# Altium schematic sheet Main.SchDoc: GMU HY
size 353 x 250 mm; Date: 17.10.2024r.; Author: Bartłomiej Smoter; CompanyName: AGH Racing; Revision: v1; SheetNumber: 1; SheetTotal: 6
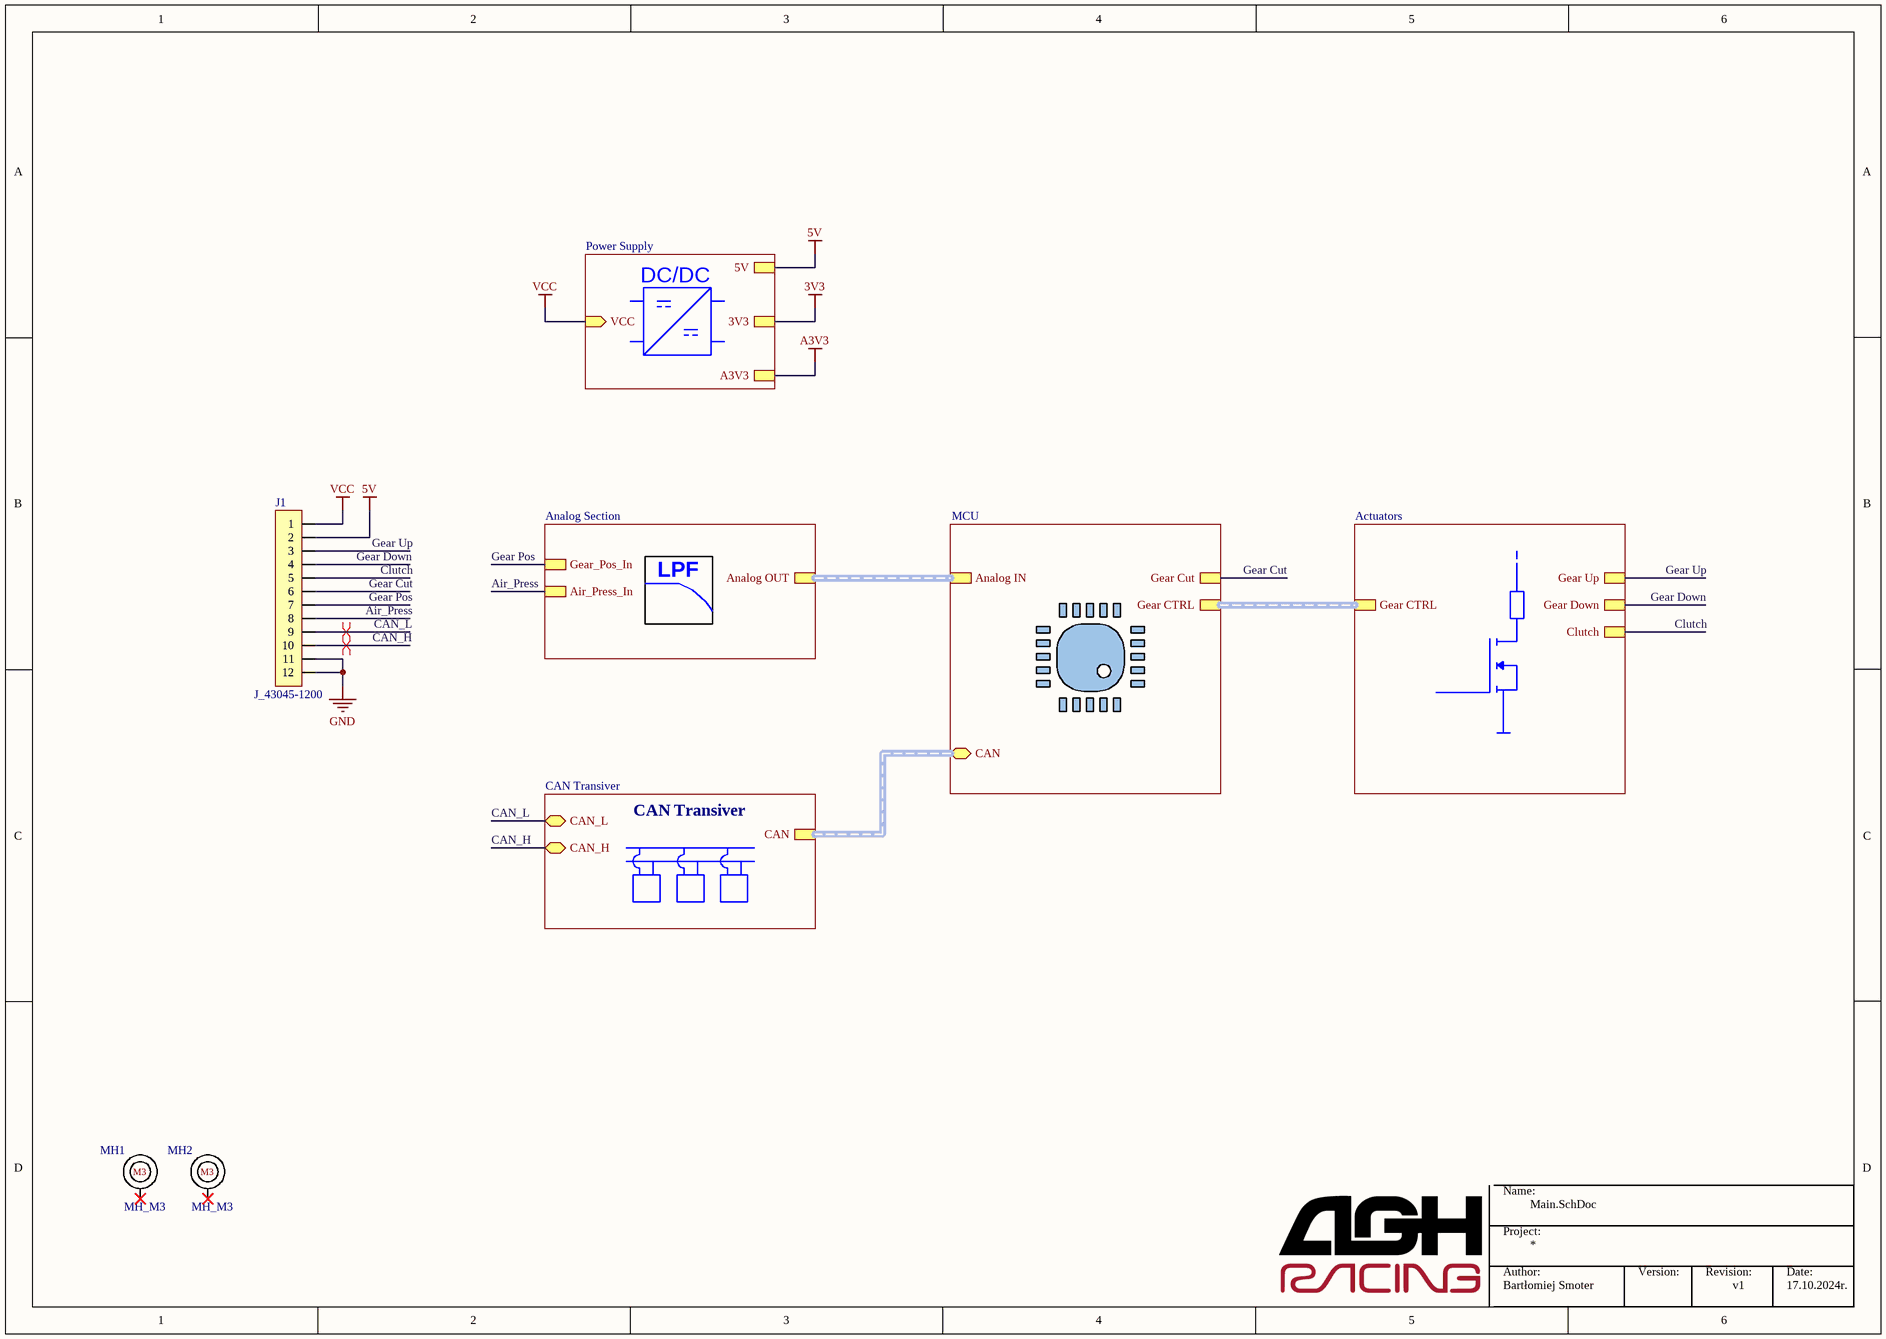
[diagram p0: Main.SchDoc]

## Parts
J1  J_43045-1200  [43045-1200]
MH1  MH_M3  [M3]  (no BOM)
MH2  MH_M3  [M3]  (no BOM)

## Sub-sheets
Actuators = Actuators: Gear Up, Gear Down, Clutch, Gear CTRL
Analog Section = Analog_Section: Gear_Pos_In, Air_Press_In, Analog OUT
CAN Transiver = CANTransiver: CAN_H (bidir), CAN_L (bidir), CAN
MCU = MCU: CAN (bidir), Gear CTRL, Gear Cut, Analog IN
Power Supply = PowerSupply: VCC (in), 3V3, 5V, A3V3

## Nets
3V3: sheet Power Supply/3V3
5V: J1.4(2) ; sheet Power Supply/5V
A3V3: sheet Power Supply/A3V3
GND: J1.1(12) J1.11
VCC: J1.7(1) ; sheet Power Supply/VCC
Air_Press: J1.12(8) ; sheet Analog Section/Air_Press_In
CAN_H: J1.2(10) ; sheet CAN Transiver/CAN_H
CAN_L: J1.8(9) ; sheet CAN Transiver/CAN_L
Clutch: J1.10(5) ; sheet Actuators/Clutch
Gear Cut: J1.5(6) ; sheet MCU/Gear Cut
Gear Down: J1.3(4) ; sheet Actuators/Gear Down
Gear Pos: J1.6(7) ; sheet Analog Section/Gear_Pos_In
Gear Up: J1.9(3) ; sheet Actuators/Gear Up

Not connected (* = marked no-connect by the designer): MH1 1*; MH2 1*

## Buses and harness runs
harness sheet Actuators/Gear CTRL = sheet MCU/Gear CTRL
harness sheet Analog Section/Analog OUT = sheet MCU/Analog IN
harness sheet CAN Transiver/CAN = sheet MCU/CAN

## Layout directives
differential pair: CAN_H, CAN_L

## Notes on the sheet
- DC/DC
- LPF
- CAN
- Transiver
- Name:
- Project:
- Author:
- Version:
- Revision:
- Date:

## Library data of the parts
J1 = CMP-002-00073-5: Male; Micro-Fit 3.0; 12 Pos. 3mm; 8.5A 600V; Right Angle THT; Mating Part Num.: 43025-1200; Revision Num.: 1; Mating Terminal Num.: 43030-0001; Pin Amount: 12; Mounting Style: Right-Angle; Man. Part Num.: 43045-1200; Series: Micro-Fit 3.0; Max Current Rating: 8.5A; Gender: Male; Pitch: 3mm; HelpURL: https://www.molex.com/en-us/products/part-detail/0430451200?display=pdf; Voltage Rating: 600V; Mounting Technology: THT
MH1 MH2 = CMP-00028-00002-1: Mounting hole; M3 Screw; 3.4mm x 4.3mm; Revision Num.: 1; Man. Part Num.: M3; Diameter: 4.3mm; Hole size: 3.4mm